# Altium schematic sheet esp32s3_nano.SchDoc
size Letter; SheetNumber: 3; SheetTotal: 3
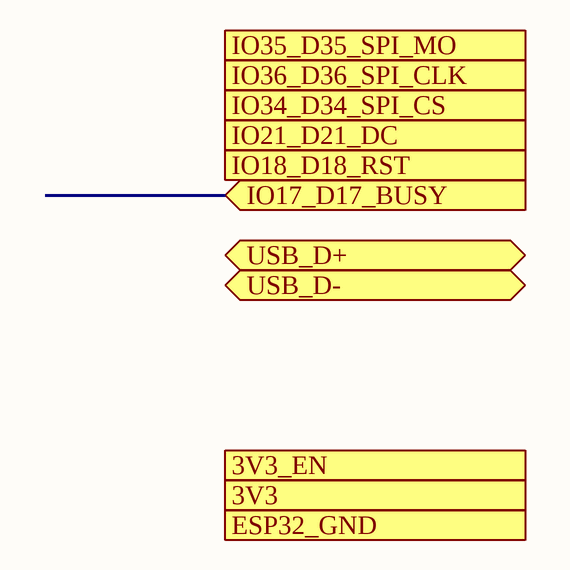
[diagram p0: esp32s3_nano.SchDoc]

## Ports
3V3 (in), 3V3_EN (in), ESP32_GND (in), IO17_D17_BUSY (in), IO18_D18_RST (out), IO21_D21_DC (out), IO34_D34_SPI_CS (out), IO35_D35_SPI_MO (out), IO36_D36_SPI_CLK (out), USB_D+ (bidir), USB_D- (bidir)